# Altium schematic sheet FLink Unit.SchDoc
size 203 x 152 mm
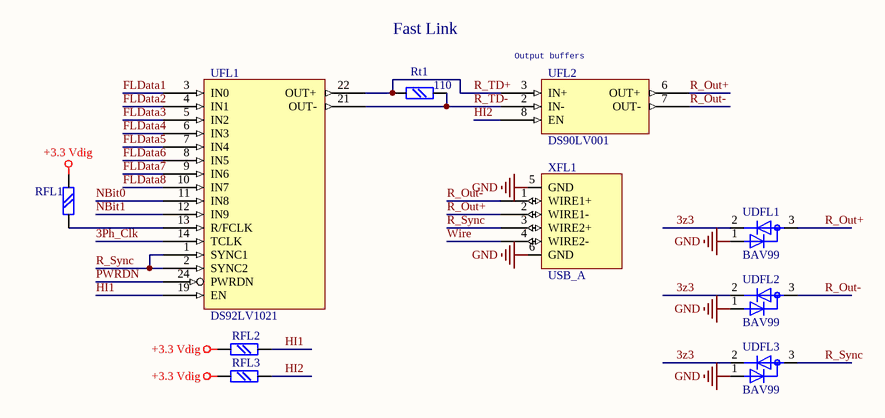
[diagram p0: FLink Unit.SchDoc]

## Parts
RFL1  CHIP0805  [CHIP0805]  (value not drawn)
RFL2  CHIP0805  [CHIP0805]  (value not drawn)
RFL3  CHIP0805  [CHIP0805]  (value not drawn)
Rt1  110  [CHIP0805]
UDFL1  BAV99  [SOT-23]
UDFL2  BAV99  [SOT-23]
UDFL3  BAV99  [SOT-23]
UFL1  DS92LV1021  [28TSSOP]
UFL2  DS90LV001  [Soic8_200]
XFL1  USB_A  [USB-A]

## Nets
+3.3 Vdig: RFL1.2 RFL2.1 RFL3.1
AGND: UFL1.18(AGND) UFL1.20(AGND) UFL1.23(AGND) UFL1.25(AGND)
AVCC: UFL1.17(AVCC) UFL1.26(AVCC)
DGND: UFL1.15(DGND) UFL1.16(DGND)
DVCC: UFL1.27(DVCC) UFL1.28(DVCC)
GND: UDFL1.1(ANODE) UDFL2.1(ANODE) UDFL3.1(ANODE) UFL2.1(GND) XFL1.5(GND) XFL1.6(GND)
VCC: UFL2.5(VCC)
3Ph_Clk: UFL1.14(TCLK)
3z3: UDFL1.2(CATHODE) UDFL2.2(CATHODE) UDFL3.2(CATHODE)
FLData1: UFL1.3(IN0)
FLData2: UFL1.4(IN1)
FLData3: UFL1.5(IN2)
FLData4: UFL1.6(IN3)
FLData5: UFL1.7(IN4)
FLData6: UFL1.8(IN5)
FLData7: UFL1.9(IN6)
FLData8: UFL1.10(IN7)
HI1: RFL2.2 UFL1.19(EN)
HI2: RFL3.2 UFL2.8(EN)
NBit0: UFL1.11(IN8)
NBit1: UFL1.12(IN9)
PWRDN: UFL1.24(PWRDN)
R_Out+: UDFL1.3(COMMON) UFL2.6(OUT+) XFL1.2(WIRE1-)
R_Out-: UDFL2.3(COMMON) UFL2.7(OUT-) XFL1.1(WIRE1+)
R_Sync: UDFL3.3(COMMON) UFL1.1(SYNC1) UFL1.2(SYNC2) XFL1.3(WIRE2+)
R_TD+: Rt1.1 UFL1.22(OUT+) UFL2.3(IN+)
R_TD-: Rt1.2 UFL1.21(OUT-) UFL2.2(IN-)
Wire: XFL1.4(WIRE2-)
NetRFL1_1: RFL1.1 UFL1.13(R/FCLK)

## Notes on the sheet
- Fast Link
- (near UFL2) Output buffers

## Library data of the parts
RFL1-RFL3 Rt1 = R: Text Field1: 20; Text Field2: 20
UDFL1-UDFL3 = BAV99: Text Field1: 30; Text Field2: 30
UFL1 = DS92LV1021: Text Field1: 90; Text Field2: 170
UFL2 = DS90LV001: Text Field1: 80; Text Field2: 40
XFL1 = USB_A: Text Field1: 60; Text Field2: 70